# EAGLE design can_switcher (EAGLE 7.5.0)
Development board for an intelligent switching system with CAN bus connectivity
CNAME: Nuclear Bunny Studios, LLC; DESIGNER: Chad Gibbons; EXTRA_DOC: Development Board for an intelligent switching system with CAN bus connectivity; REVISION: 1.0
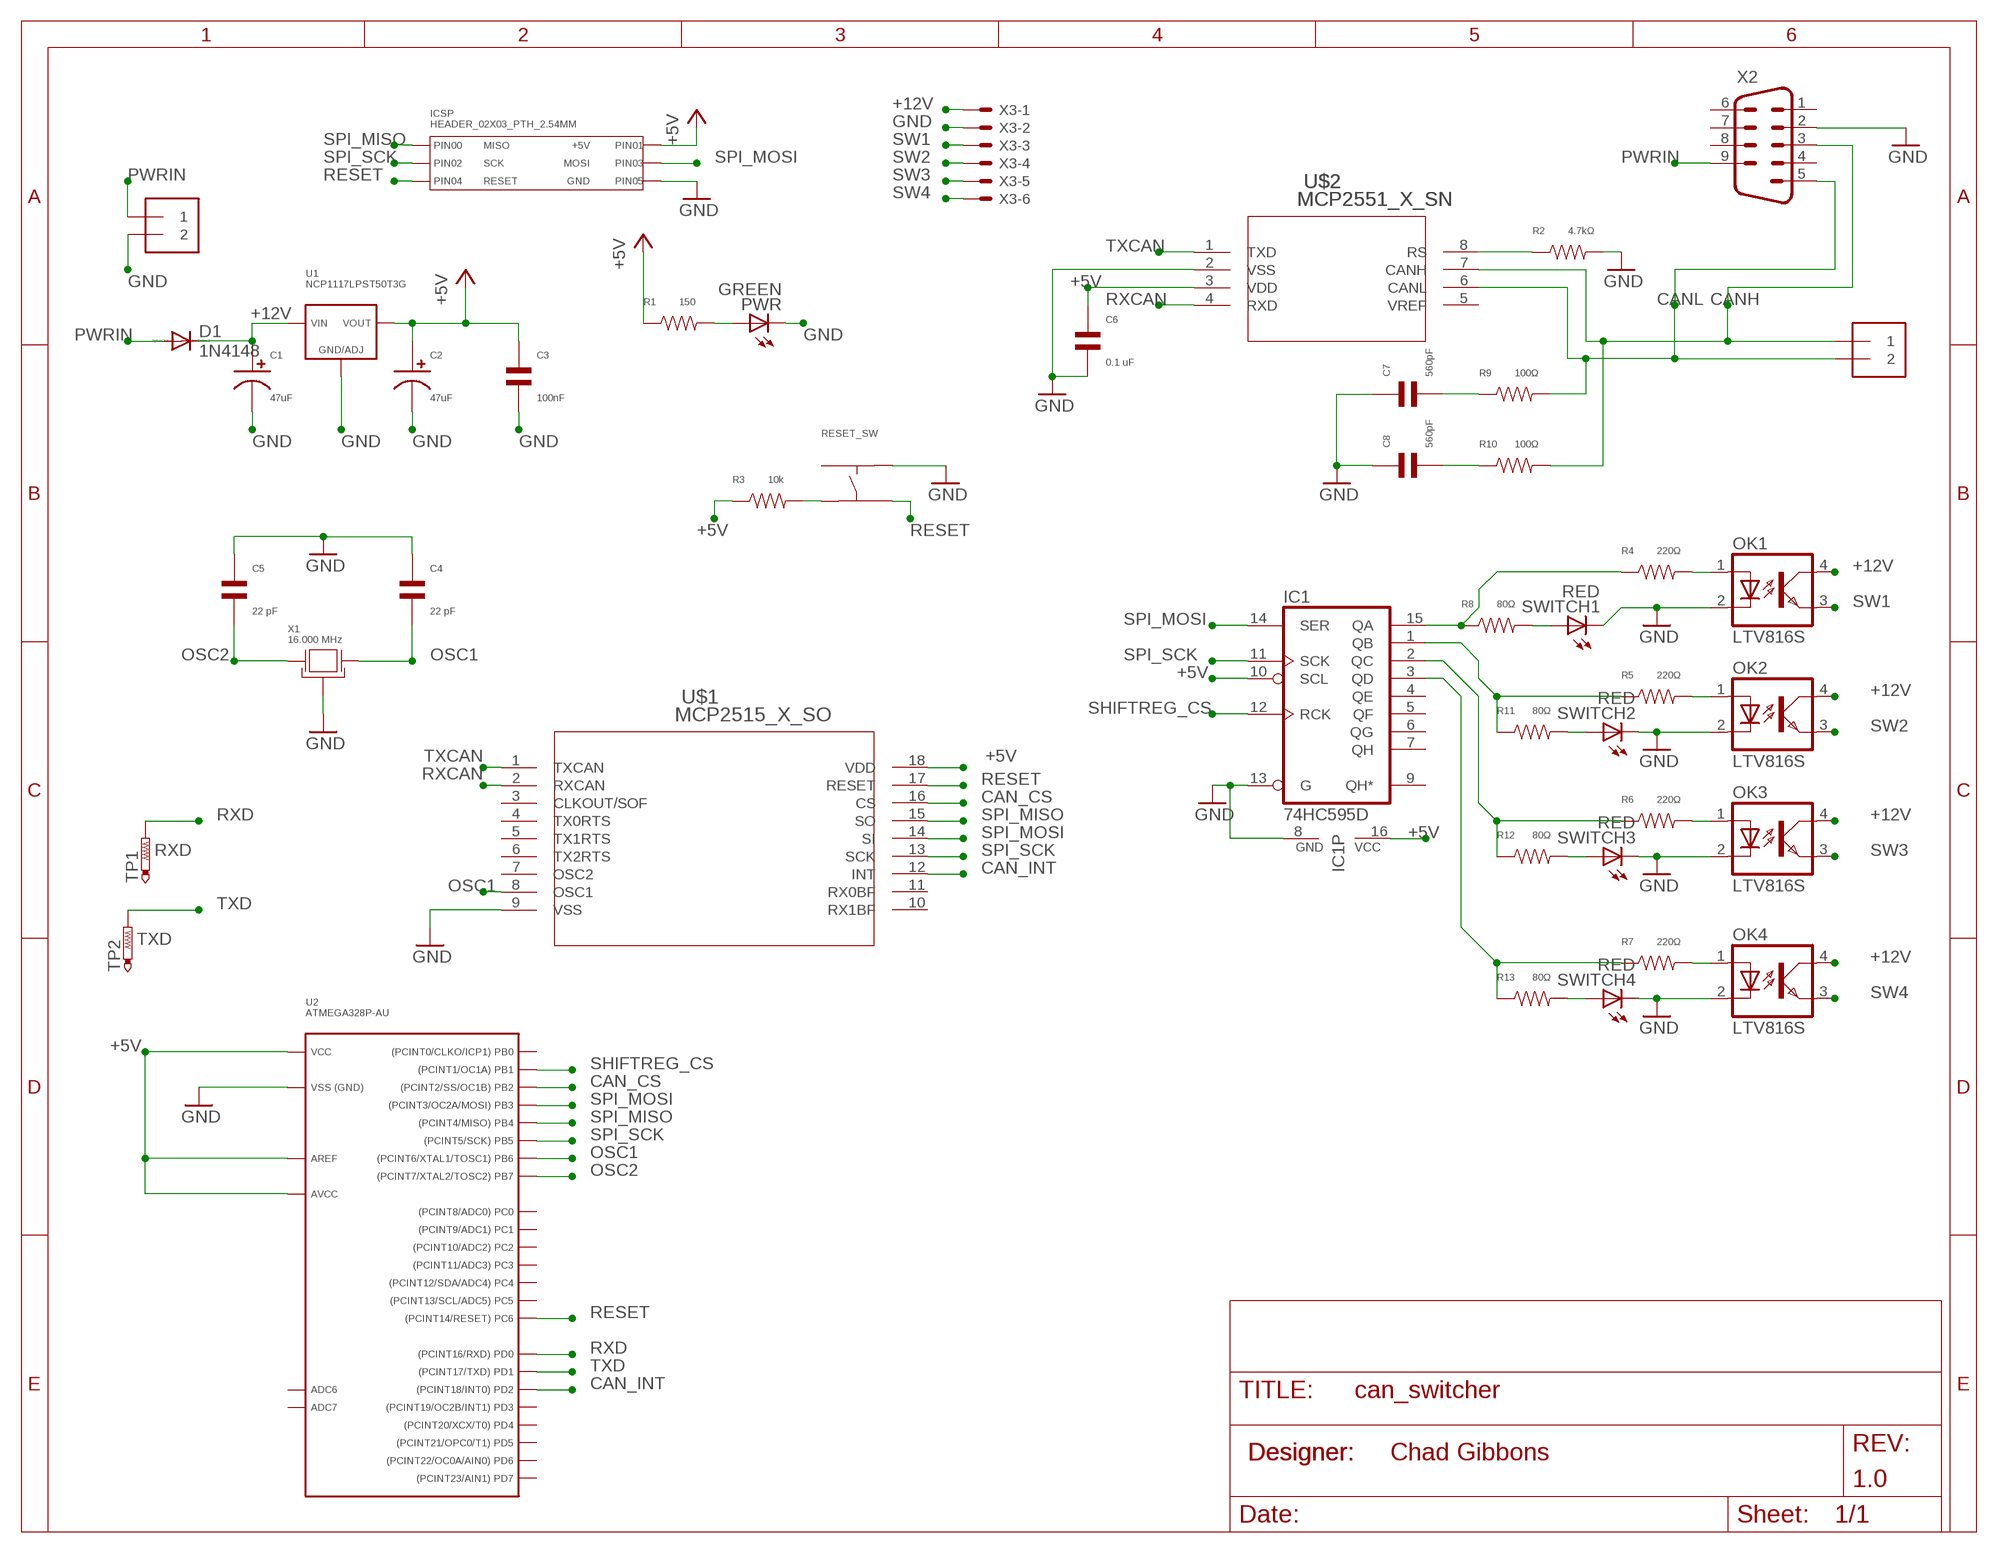
[diagram p0: schematic, sheet 1]

## Parts
C1  47uF  CAPACITOR_P_6.3MM  [CP6.3MM]
C2  47uF  CAPACITOR_P_6.3MM  [CP6.3MM]
C3  100nF  CAPACITOR_NP_0603  [C0603]
C4  22 pF  CAPACITOR_NP_0603  [C0603]
C5  22 pF  CAPACITOR_NP_0603  [C0603]
C6  0.1 uF  CAPACITOR_NP_0603  [C0603]
C7  560pF  CAPACITOR_NP_0603  [C0603]
C8  560pF  CAPACITOR_NP_0603  [C0603]
CANBUS  1X2-3.5MM  [1X2-3.5MM]
D1  1N4148  DIODE-SMB  [SMB]
IC1  74HC595D  [SO16]
ICSP  HEADER_02X03_PTH_2.54MM  [PTH_2.54MM_02X03]
J3  1X2-3.5MM  [1X2-3.5MM]
OK1  LTV816S  [SMD4]
OK2  LTV816S  [SMD4]
OK3  LTV816S  [SMD4]
OK4  LTV816S  [SMD4]
PWR  GREEN  LEDSML0603  [SML0603]
R1  150  RESISTOR_0603  [R0603]
R2  4.7kΩ  RESISTOR_0603  [R0603]
R3  10k  RESISTOR_0603  [R0603]
R4  220Ω  RESISTOR_0603  [R0603]
R5  220Ω  RESISTOR_0603  [R0603]
R6  220Ω  RESISTOR_0603  [R0603]
R7  220Ω  RESISTOR_0603  [R0603]
R8  80Ω  RESISTOR_0603  [R0603]
R9  100Ω  RESISTOR_0603  [R0603]
R10  100Ω  RESISTOR_0603  [R0603]
R11  80Ω  RESISTOR_0603  [R0603]
R12  80Ω  RESISTOR_0603  [R0603]
R13  80Ω  RESISTOR_0603  [R0603]
RESET_SW  TACT_6MM  [TACT6MM]
SWITCH1  RED  LEDSML0603  [SML0603]
SWITCH2  RED  LEDSML0603  [SML0603]
SWITCH3  RED  LEDSML0603  [SML0603]
SWITCH4  RED  LEDSML0603  [SML0603]
TP1  PTR1B1,27  [B1,27]
TP2  PTR1B1,27  [B1,27]
U1  NCP1117LPST50T3G  [SOT-223-3]
U2  ATMEGA328P-AU  [TQFP32]
U$1  MCP2515_X_SO  [SOIC18_W_MC]
U$2  MCP2551_X_SN  [SOIC8_N_MC]
X1  16.000 MHz  XTL_5MMX3.2MM  [5MMX3.2MM]
X2  M09HP  [M09HP]
X3  22-23-2061  [22-23-2061]

## Nets
+5V: C2.P$1 C3.P$1 C6.P$1 IC1.10(SCL) IC1.16(VCC) ICSP.P$2(PIN1) R1.P$1 R3.P$1 U1.P$1(VOUT) U1.P$3(VOUT) U2.P$4(VCC) U2.P$6(VCC) U2.P$18(AVCC) U2.P$20(AREF) U$1.18(VDD) U$2.3(VDD)
+12V: C1.P$1 D1.C OK1.4(COL) OK2.4(COL) OK3.4(COL) OK4.4(COL) U1.P$4(VIN) X3.1
CAN_CS: U2.P$14(PB2) U$1.16(CS)
CAN_INT: U2.P$32(PD2) U$1.12(INT)
CANH: CANBUS.1 R10.P$2 U$2.7(CANH) X2.3
CANL: CANBUS.2 R9.P$2 U$2.6(CANL) X2.5
GND: C1.P$2 C2.P$2 C3.P$2 C4.P$1 C5.P$1 C6.P$2 C7.P$1 C8.P$1 IC1.8(GND) IC1.13(G) ICSP.P$6(PIN5) J3.2 OK1.2(C) OK2.2(C) OK3.2(C) OK4.2(C) PWR.C R2.P$2 RESET_SW.P$2 SWITCH1.C SWITCH2.C SWITCH3.C SWITCH4.C U1.P$2(GND/ADJ) U2.P$3(GND) U2.P$5(GND) U2.P$21(GND) U$1.9(VSS) U$2.2(VSS) X1.P$2(GND) X1.P$4(GND) X2.2 X3.2
N$1: PWR.A R1.P$2
N$2: R2.P$1 U$2.8(RS)
N$3: R3.P$2 RESET_SW.P$3
N$4: R8.P$2 SWITCH1.A
N$9: R11.P$2 SWITCH2.A
N$10: R12.P$2 SWITCH3.A
N$11: R13.P$2 SWITCH4.A
N$17: OK4.1(A) R7.P$2
N$18: OK3.1(A) R6.P$2
N$19: OK2.1(A) R5.P$2
N$20: OK1.1(A) R4.P$2
N$21: IC1.15(QA) R4.P$1 R8.P$1
N$22: IC1.1(QB) R5.P$1 R11.P$1
N$23: IC1.2(QC) R6.P$1 R12.P$1
N$24: IC1.3(QD) R7.P$1 R13.P$1
N$37: C7.P$2 R9.P$1
N$38: C8.P$2 R10.P$1
OSC1: C4.P$2 U2.P$7(PB6) U$1.8(OSC1) X1.P$3(X1)
OSC2: C5.P$2 U2.P$8(PB7) X1.P$1(X0)
PWRIN: D1.A J3.1 X2.9
RESET: ICSP.P$5(PIN4) RESET_SW.P$4 U2.P$29(PC6) U$1.17(RESET)
RXCAN: U$1.2(RXCAN) U$2.4(RXD)
RXD: TP1.TP U2.P$30(PD0)
SHIFTREG_CS: IC1.12(RCK) U2.P$13(PB1)
SPI_MISO: ICSP.P$1(PIN0) U2.P$16(PB4) U$1.15(SO)
SPI_MOSI: IC1.14(SER) ICSP.P$4(PIN3) U2.P$15(PB3) U$1.14(SI)
SPI_SCK: IC1.11(SCK) ICSP.P$3(PIN2) U2.P$17(PB5) U$1.13(SCK)
SW1: OK1.3(EMIT) X3.3
SW2: OK2.3(EMIT) X3.4
SW3: OK3.3(EMIT) X3.5
SW4: OK4.3(EMIT) X3.6
TXCAN: U$1.1(TXCAN) U$2.1(TXD)
TXD: TP2.TP U2.P$31(PD1)
Unconnected: IC1.4(QE) IC1.5(QF) IC1.6(QG) IC1.7(QH) IC1.9(QH*) RESET_SW.P$1 U2.P$1(PD3) U2.P$2(PD4) U2.P$9(PD5) U2.P$10(PD6) U2.P$11(PD7) U2.P$12(PB0) U2.P$19(ADC6) U2.P$22(ADC7) U2.P$23(PC0) U2.P$24(PC1) U2.P$25(PC2) U2.P$26(PC3) U2.P$27(PC4) U2.P$28(PC5) U$1.3(CLKOUT/SOF) U$1.4(TX0RTS) U$1.5(TX1RTS) U$1.6(TX2RTS) U$1.7(OSC2) U$1.10(RX1BF) U$1.11(RX0BF) U$2.5(VREF) X2.1 X2.4 X2.6 X2.7 X2.8

## Library data of the parts
C1 C2 = MF_Passives:CAPACITOR_P: Library: MF_Passives Description: Device for Polarized Capacitors. Manufacture part number (MFG#), Voltage Rating, and Tolerance can be added via Attributes.; MFG#: MF-CAP-6.3MM-47uF; TOLERANCE: N/A; VOTLAGE: N/A
C3-C6 = MF_Passives:CAPACITOR_NP: Library: MF_Passives Description: Device for Non-Polarized Capacitors. Manufacture part number (MFG#), Voltage, Temperature Coefficient, and Tolerance can be added via Attributes.; MFG#: N/A; TEMP_COF: N/A; TOLERANCE: N/A; VOLTAGE: N/A
C7 C8 = MF_Passives:CAPACITOR_NP: Library: MF_Passives Description: Device for Non-Polarized Capacitors. Manufacture part number (MFG#), Voltage, Temperature Coefficient, and Tolerance can be added via Attributes.; MFG#: C0603C561J5GACTU; TEMP_COF: N/A; TOLERANCE: N/A; VOLTAGE: N/A
CANBUS = adafruit:1X2: 3.5mm Terminal block http://www.ladyada.net/library/pcb/eaglelibrary.html; LABEL00: CANH; LABEL01: CANL
D1 = diode:DIODE-: DIODE
IC1 = 74xx-eu:74*595: 8-bit SHIFT REGISTER, output latch
ICSP = MF_Connectors:HEADER_02X03: Library: MF_Connectors Description: Header Connector with 6 Positions and 02 Rows. Use the LABEL Attribute to label the pin on the schematic and PCB. You can remove the attributes on the PCB by using the SMASH function on the part and then deleting the text.; LABEL00: MISO; LABEL01: +5V; LABEL02: SCK; LABEL03: MOSI; LABEL04: RESET; LABEL05: GND
J3 = adafruit:1X2: 3.5mm Terminal block http://www.ladyada.net/library/pcb/eaglelibrary.html
OK1-OK4 = optocoupler:LTV816: OPTO COUPLER Source: LITEON, LTV816.pdf; MPN: LTV-816S-TA; OC_FARNELL: unknown; OC_NEWARK: unknown
PWR SWITCH1-SWITCH4 = led:LED: LED OSRAM: - CHIPLED LG R971, LG N971, LY N971, LG Q971, LY Q971, LO R971, LY R971 LH N974, LH R974 LS Q976, LO Q976, LY Q976 LO Q996 - Hyper CHIPLED LW Q18S LB Q993, LB Q99A, LB R99A - SideLED LS A670, LO A670, LY A670, LG A670, LP A670 LB A673, LV A673, LT A673, LW A673 LH A674 LY A675 LS A676, LA A676, LO A676, LY A676, LW A676 LS A679, LY A679, LG A679 - Hyper Micro SIDELED® LS Y876, LA Y876, LO Y876, LY Y876 LT Y87S - SmartLED LW L88C, LW L88S LB L89C, LB L89S, LG L890 LS L89K, LO L89K, LY L89K LS L896, LA L896, LO L896, LY L896 - TOPLED LS T670, LO T670, LY T670, LG T670, LP T670 LSG T670, LSP T670, LSY T670, LOP T670, LYG T670 LG T671, LOG T671, LSG T671 LB T673, LV T673, LT T673, LW T673 LH T674 LS T676, LA T676, LO T676, LY T676, LB T676, LH T676, LSB T676, LW T676 LB T67C, LV T67C, LT T67C, LS T67K, LO T67K, LY T67K, LW E67C LS E67B, LA E67B, LO E67B, LY E67B, LB E67C, LV E67C, LT E67C LW T67C LS T679, LY T679, LG T679 LS T770, LO T770, LY T770, LG T770, LP T770 LB T773, LV T773, LT T773, LW T773 LH T774 LS E675, LA E675, LY E675, LS T675 LS T776, LA T776, LO T776, LY T776, LB T776 LHGB T686 LT T68C, LB T68C - Hyper Mini TOPLED® LB M676 - Mini TOPLED Santana® LG M470 LS M47K, LO M47K, LY M47K Source: http://www.osram.convergy.de LUXEON: - LUMILED® LXK2-PW12-R00, LXK2-PW12-S00, LXK2-PW14-U00, LXK2-PW14-V00 LXK2-PM12-R00, LXK2-PM12-S00, LXK2-PM14-U00 LXK2-PE12-Q00, LXK2-PE12-R00, LXK2-PE12-S00, LXK2-PE14-T00, LXK2-PE14-U00 LXK2-PB12-K00, LXK2-PB12-L00, LXK2-PB12-M00, LXK2-PB14-N00, LXK2-PB14-P00, LXK2-PB14-Q00 LXK2-PR12-L00, LXK2-PR12-M00, LXK2-PR14-Q00, LXK2-PR14-R00 LXK2-PD12-Q00, LXK2-PD12-R00, LXK2-PD12-S00 LXK2-PH12-R00, LXK2-PH12-S00 LXK2-PL12-P00, LXK2-PL12-Q00, LXK2-PL12-R00 Source: www.luxeon.com KINGBRIGHT: KA-3528ASYC Source: www.kingbright.com
R1 = MF_Passives:RESISTOR: Library: MF_Passives Description: Device for Resistors. Manufacture part number (MFG#), Voltage, Tolerance, and Wattage Rating can be added via Attributes.; MFG#: RC0603FR-07150RL; TOLERANCE: N/A; VOLTAGE: N/A; WATTAGE: N/A
R2-R13 = MF_Passives:RESISTOR: Library: MF_Passives Description: Device for Resistors. Manufacture part number (MFG#), Voltage, Tolerance, and Wattage Rating can be added via Attributes.; MFG#: N/A; TOLERANCE: N/A; VOLTAGE: N/A; WATTAGE: N/A
RESET_SW = MF_Switches:TACT: Library: MF_Switches Description: Device for Tact Switches. Manufacture part number (MFG#) can be added via Attributes.; MFG#: MF-SW-TACT-6MM
TP1 = testpad:PTR1: TEST PIN; TP_SIGNAL_NAME: RXD
TP2 = testpad:PTR1: TEST PIN; TP_SIGNAL_NAME: TXD
U1 = MF_IC_Power:NCP1117LP: Manufacturer Part #: NCP1117LP Manufacturer: ON Semiconductor Description: LDO Voltage Regulators
U2 = MF_IC_Digital:ATMEGA328P: Manufacturer Part #: ATMEGA328P Manufacturer: Atmel Description: 8-bit Microcontrollers - MCU 32KB In-system Flash 20MHz 1.8V-5.5V
U$1 = microchip_can:MCP2515_X_SO
U$2 = microchip_can:MCP2551_X_SN
X1 = MF_Frequency_Control:XTL: Library: MF_Frequency_Control Description: Device for Cyrstal Oscillators. Manufacture part number (MFG#) can be added via Attributes.; MFG#: ASFL1-16.000MHZ-EC-T
X2 = con-subd:M09: SUB-D; MPN: L717SDE09P1ACH; OC_FARNELL: unknown; OC_NEWARK: unknown
X3 = con-molex:22-23-2061: .100" (2.54mm) Center Header - 6 Pin; MF: MOLEX; MPN: 22-23-2061; OC_FARNELL: 1462922; OC_NEWARK: 27C1933

## Board
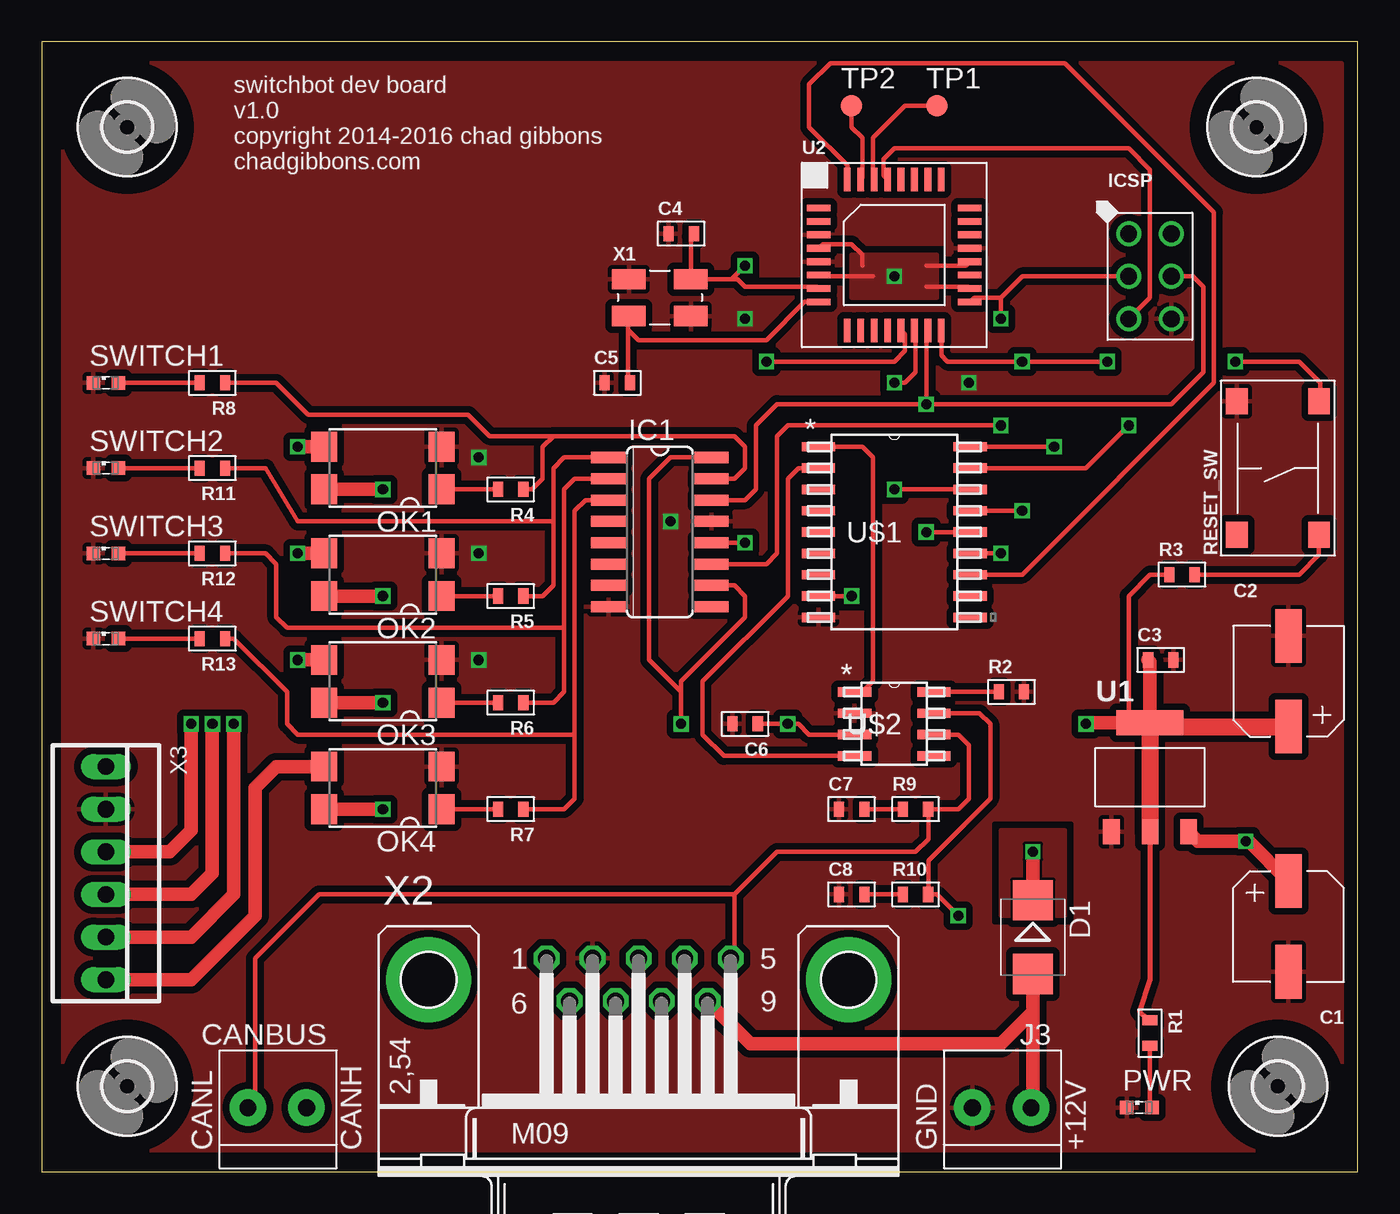
[diagram p1: board, top side]
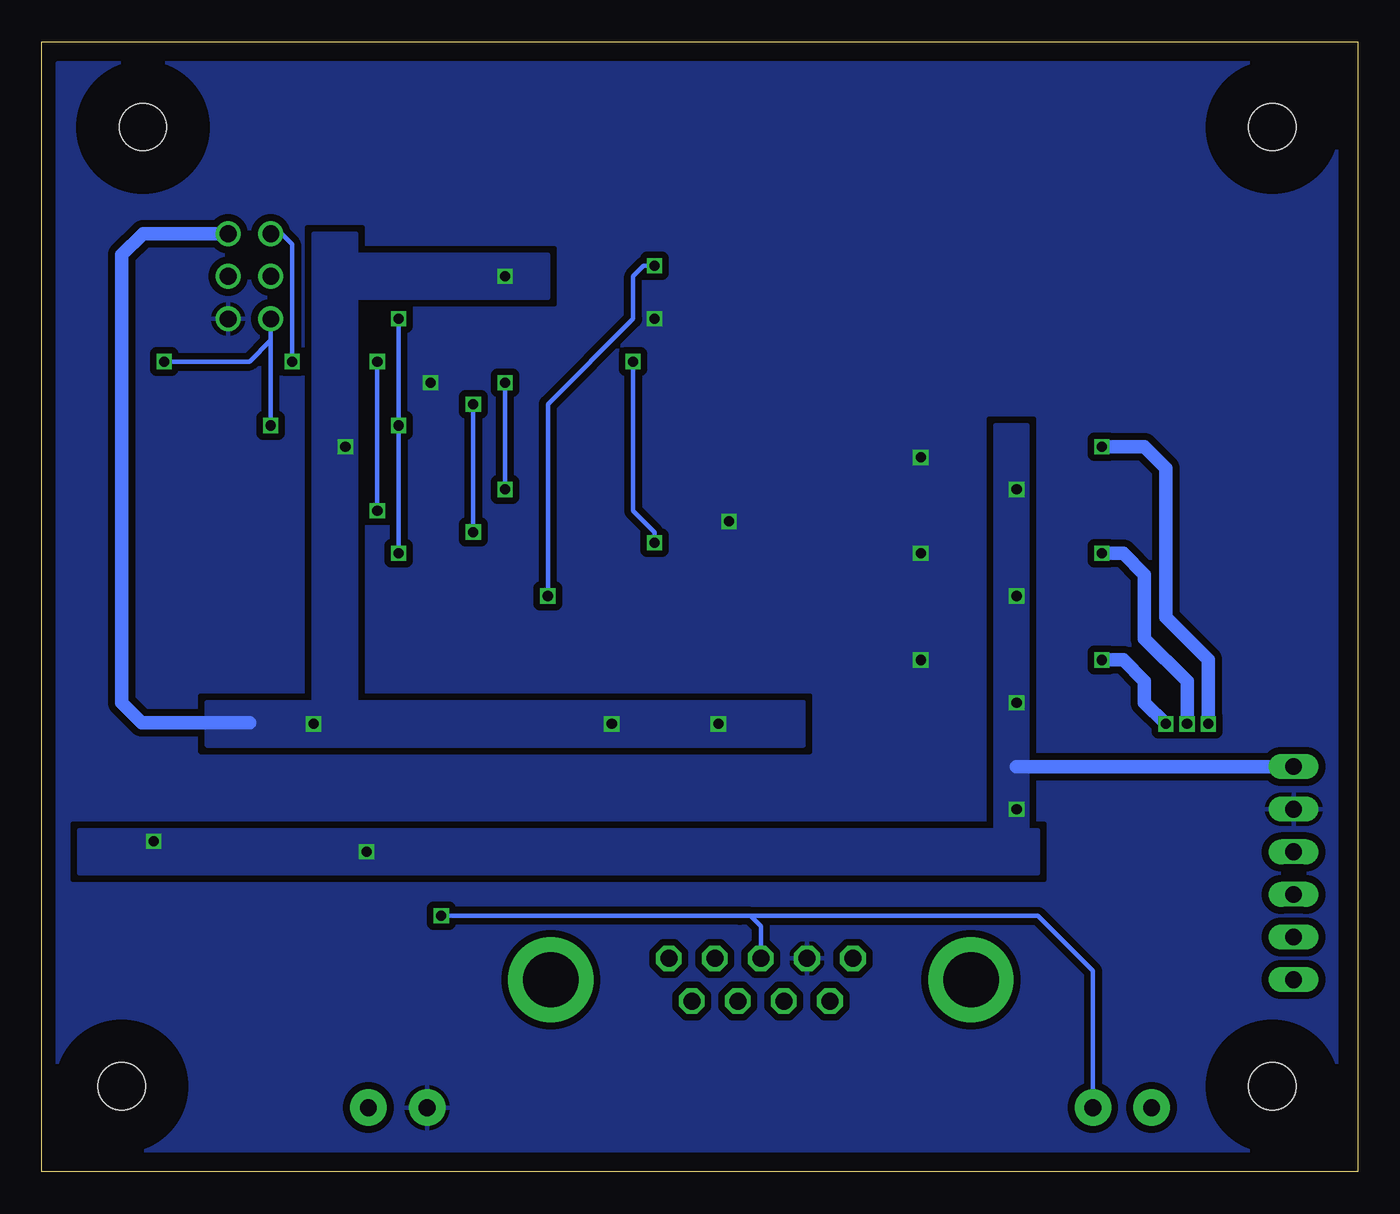
[diagram p2: board, bottom side, seen from below]

Size 78.41 x 67.3 mm. Coordinates in mm from the lower left corner, seen from the top.
Outline: 0,0 78.41,0 78.41,67.3 0,67.3 0,0
Copper layers (1*16): Top 0.035mm / dielectric 0.2mm / Bottom 0.035mm
Design rules "MF_2_Layer": minimum track width 6mil, minimum drill 12mil, track to track 6mil, track to pad 6mil, pad to pad 6mil, via to via 6mil, smd to smd 0mil, copper to edge 10mil, drill to drill 10mil, minimum pad ring 6mil, minimum via ring 6mil, stop-mask expansion 2mil, vias tented up to drill 25mil, thermal gap 10mil

### Footprints (pad centres in the part's own frame; a part is rotated, then mirrored left to right if it is on the bottom)
CP6.3MM = smd 1.6 x 3.2: P$1 0,-2.7; P$2 0,2.7
C0603 = smd 0.6 x 0.9: P$1 -0.75,0; P$2 0.75,0
1X2-3.5MM = drill 1 pad 2.184: 1 1.8,0; 2 -1.7,0
SMB = smd 2.4 x 2.4: A 2.2,0; C -2.2,0
SO16 = smd 0.66 x 2.032: 1 -4.445,-3.073; 2 -3.175,-3.073; 3 -1.905,-3.073; 4 -0.635,-3.073; 5 0.635,-3.073; 6 1.905,-3.073; 7 3.175,-3.073; 8 4.445,-3.073; 9 4.445,3.073; 10 3.175,3.073; 11 1.905,3.073; 12 0.635,3.073; 13 -0.635,3.073; 14 -1.905,3.073; 15 -3.175,3.073; 16 -4.445,3.073
PTH_2.54MM_02X03 = drill 1: P$1 -2.54,-1.27; P$2 -2.54,1.27; P$3 0,-1.27; P$4 0,1.27; P$5 2.54,-1.27; P$6 2.54,1.27
SMD4 = smd 1.78 x 1.55: 1 -1.27,-3.5; 2 1.27,-3.5; 3 1.27,3.5; 4 -1.27,3.5
SML0603 = smd 0.8 x 0.8: A 0.75,0; C -0.75,0
R0603 = smd 0.6 x 0.9: P$1 -0.75,0; P$2 0.75,0
TACT6MM = smd 1.55 x 1.3: P$1 -3.975,2.45; P$2 3.975,2.45; P$3 -3.975,-2.45; P$4 3.975,-2.45
B1,27 = smd 1.27 x 1.27: TP 0,0
SOT-223-3 = smd 4 x 1.5: P$1 0,3.25 | smd 1 x 1.5: P$2 -2.3,-3.25; P$3 0,-3.25; P$4 2.3,-3.25
TQFP32 = smd 1.4 x 0.4: P$1 -4.5,2.8; P$2 -4.5,2; P$3 -4.5,1.2; P$4 -4.5,0.4; P$5 -4.5,-0.4; P$6 -4.5,-1.2; P$7 -4.5,-2; P$8 -4.5,-2.8; P$17 4.5,-2.8; P$18 4.5,-2; P$19 4.5,-1.2; P$20 4.5,-0.4; P$21 4.5,0.4; P$22 4.5,1.2; P$23 4.5,2; P$24 4.5,2.8 | smd 0.4 x 1.4: P$9 -2.8,-4.5; P$10 -2,-4.5; P$11 -1.2,-4.5; P$12 -0.4,-4.5; P$13 0.4,-4.5; P$14 1.2,-4.5; P$15 2,-4.5; P$16 2.8,-4.5; P$25 2.8,4.5; P$26 2,4.5; P$27 1.2,4.5; P$28 0.4,4.5; P$29 -0.4,4.5; P$30 -1.2,4.5; P$31 -2,4.5; P$32 -2.8,4.5
SOIC18_W_MC = smd 1.981 x 0.559: 1 -4.521,5.08; 2 -4.521,3.81; 3 -4.521,2.54; 4 -4.521,1.27; 5 -4.521,0; 6 -4.521,-1.27; 7 -4.521,-2.54; 8 -4.521,-3.81; 9 -4.521,-5.08; 10 4.521,-5.08; 11 4.521,-3.81; 12 4.521,-2.54; 13 4.521,-1.27; 14 4.521,0; 15 4.521,1.27; 16 4.521,2.54; 17 4.521,3.81; 18 4.521,5.08
SOIC8_N_MC = smd 1.981 x 0.559: 1 -2.362,1.905; 2 -2.362,0.635; 3 -2.362,-0.635; 4 -2.362,-1.905; 5 2.362,-1.905; 6 2.362,-0.635; 7 2.362,0.635; 8 2.362,1.905
2,8 = hole 2.8: 0,0
5MMX3.2MM = smd 2 x 1.2: P$1 -1.85,-1.1; P$2 1.85,-1.1; P$3 1.85,1.1; P$4 -1.85,1.1
M09HP = drill 1.016 octagon: 1 -5.486,1.27; 2 -2.743,1.27; 3 0,1.27; 4 2.743,1.27; 5 5.486,1.27; 6 -4.115,-1.27; 7 -1.372,-1.27; 8 1.372,-1.27; 9 4.115,-1.27 | drill 3.302 pad 5.08: G1 -12.522,0; G2 12.522,0
22-23-2061 = drill 1 long: 1 -6.35,0; 2 -3.81,0; 3 -1.27,0; 4 1.27,0; 5 3.81,0; 6 6.35,0

### Placement (x,y rotation side)
C1  74.3,14.61 180 top
C2  74.3,29.21 0 top
C3  66.67,30.48 0 top
C4  38.1,55.88 0 top
C5  34.29,46.99 0 top
C6  41.91,26.67 180 top
C7  48.26,21.59 0 top
C8  48.26,16.51 0 top
CANBUS  13.97,3.81 0 top
D1  59.05,13.97 270 top
IC1  36.83,38.1 270 top
ICSP  66.04,53.34 270 top
J3  57.15,3.81 0 top
OK1  20.32,41.91 90 top
OK2  20.32,35.56 90 top
OK3  20.32,29.21 90 top
OK4  20.32,22.86 90 top
PWR  65.41,3.81 0 top
R1  66.04,8.26 270 top
R2  57.78,28.57 0 top
R3  67.94,35.56 0 top
R4  27.94,40.64 180 top
R5  27.94,34.29 180 top
R6  27.94,27.94 180 top
R7  27.94,21.59 180 top
R8  10.16,46.99 180 top
R9  52.07,21.59 0 top
R10  52.07,16.51 0 top
R11  10.16,41.91 180 top
R12  10.16,36.83 180 top
R13  10.16,31.75 180 top
RESET_SW  73.66,41.91 90 top
SWITCH1  3.81,46.99 0 top
SWITCH2  3.81,41.91 0 top
SWITCH3  3.81,36.83 0 top
SWITCH4  3.81,31.75 0 top
TP1  53.34,63.5 0 top
TP2  48.26,63.5 0 top
U1  66.04,23.5 0 top
U2  50.8,54.61 0 top
U$1  50.8,38.1 0 top
U$2  50.8,26.67 0 top
U$3  [2,8]  5.08,5.08 0 top
U$4  [2,8]  73.66,5.08 0 top
U$5  [2,8]  72.39,62.23 0 top
U$6  [2,8]  5.08,62.23 0 top
X1  36.83,52.07 0 top
X2  35.56,11.43 0 top
X3  3.81,17.78 270 top

### Tracks (layer width: path | path; a pad name or v marks a point on that pad's centre or on a via)
+5V  (via drill 0.6)
  Top 0.254: C6.P$1 v44.45,26.67 45.09,26.67 45.72,26.04 U$2.3 | 38.1,28.57 38.1,29.21 41.91,33.02 41.91,34.29 41.27,34.92 IC1.10 | 38.1,28.57 v38.1,26.67 | U2.P$6 46.37,53.34 49.53,53.34 | U2.P$18 55.2,52.7 52.7,52.7 | U2.P$4 46.53,55.24 48.26,55.24 48.9,54.61 48.9,53.98 | R3.P$1 66.04,35.56 64.77,34.29 64.77,26.75 | U2.P$20 55.06,53.98 52.7,53.98 | U$1.18 v60.33,43.18 | IC1.16 37.47,42.55 36.2,41.27 36.2,30.48 38.1,28.57
  Top 0.305: U1.P$3 66.04,11.43 65.41,9.53 R1.P$1
  Top 0.813: v62.23,26.67 62.3,26.75 64.77,26.75 U1.P$1 66.04,30.36 C3.P$1
  Top 1.016: U1.P$3 U1.P$1 66.28,26.51 C2.P$1
  Bottom 0.813: ICSP.P$2 72.39,55.88 73.66,54.61 73.66,27.94 72.47,26.75 U1.P$1
  other vias: 50.8,53.34
  pour Bottom (isolate 0.305): 68.58,27.94 68.58,25.4 33.02,25.4 33.02,27.94
  pour Top: 48.26,54.61 48.26,52.07 53.34,52.07 53.34,54.61
  pour Bottom: 59.69,25.4 62.23,25.4 62.23,55.88 59.69,55.88
  pour Bottom: 48.26,54.61 62.23,54.61 62.23,52.07 48.26,52.07
+12V  (via drill 0.6)
  Top 0.813: OK4.4 v20.32,21.59 | OK3.4 v20.32,27.94 | OK2.4 v20.32,34.29 | OK1.4 v20.32,40.64 | U1.P$4 68.9,19.68 v71.75,19.68 71.92,19.68 C1.P$1 | D1.C v59.05,19.05
  Bottom 0.813: X3.1 20.32,24.13
  pour Bottom (rank 2): 19.68,20.32 21.59,20.32 21.59,44.45 19.68,44.45
  pour Bottom (isolate 0.305): 76.2,20.32 76.2,17.78 19.05,17.78 19.05,20.32
CAN_CS  (via drill 0.6)
  Top 0.254: U2.P$14 52.07,50.04 52.07,47.62 51.44,46.99 v50.8,46.99 | U$1.16 v50.8,40.64
  Bottom 0.254: v50.8,40.64 v50.8,46.99
CAN_INT
  Top 0.254: U2.P$32 48,59.95 45.72,62.23 45.72,64.77 46.99,66.04 60.96,66.04 69.85,57.15 69.85,46.99 58.42,35.56 U$1.12
CANH  (via drill 0.6)
  Top 0.254: v54.61,15.24 53.34,16.51 R10.P$2 52.82,18.53 56.52,22.23 56.52,26.67 55.88,27.3 U$2.7
  Bottom 0.254: X2.3 35.56,14.61 36.2,15.24 | 36.2,15.24 36.83,15.24 v54.61,15.24 | 36.2,15.24 19.05,15.24 15.77,11.96 CANBUS.1
CANL
  Top 0.254: X2.5 41.27,12.93 41.27,16.51 | 41.27,16.51 43.81,19.05 52.07,19.05 52.82,19.8 R9.P$2 54.61,21.59 55.24,22.23 55.24,25.4 54.61,26.04 U$2.6 | CANBUS.2 12.7,4.24 12.7,12.7 16.51,16.51 41.27,16.51
GND  (via drill 0.6)
  other vias: 26.04,42.55 26.04,36.83 26.04,30.48 41.91,50.8 55.24,46.99 37.47,38.73
  pour Top (isolate 0.406, rank 6): 1.27,66.04 1.27,1.27 77.47,1.27 77.47,66.04
  pour Bottom (isolate 0.406, rank 6): 1.27,66.04 1.27,1.27 77.47,1.27 77.47,66.04
  pour Top: 10.16,66.04 10.16,58.42 41.91,58.42 41.91,66.04
N$1
  Top 0.254: PWR.A 66.04,3.92 R1.P$2
N$2
  Top 0.254: U$2.8 R2.P$1
N$3
  Top 0.254: R3.P$2 74.93,35.56 76.11,36.74 RESET_SW.P$3
N$4
  Top 0.254: R8.P$2 SWITCH1.A
N$9
  Top 0.254: R11.P$2 SWITCH2.A
N$10
  Top 0.254: R12.P$2 SWITCH3.A
N$11
  Top 0.254: R13.P$2 SWITCH4.A
N$12
  pour Top: 57.15,15.24 60.96,15.24 60.96,20.32 57.15,20.32
N$17
  Top 0.254: R7.P$2 OK4.1
N$18
  Top 0.254: OK3.1 R6.P$2
N$19
  Top 0.254: R5.P$2 OK2.1
N$20
  Top 0.254: OK1.1 R4.P$2
N$21
  Top 0.254: IC1.15 41.27,41.27 41.91,41.91 41.91,43.18 41.27,43.81 30.48,43.81 | 30.48,43.81 29.84,43.18 29.84,41.27 29.21,40.64 R4.P$1 | R8.P$1 13.97,46.99 15.88,45.09 25.4,45.09 26.67,43.81 30.48,43.81
N$22
  Top 0.254: IC1.1 31.11,42.55 30.48,41.91 30.48,38.73 | 30.48,38.73 30.48,34.92 29.84,34.29 R5.P$1 | R11.P$1 13.34,41.91 15.24,38.73 30.48,38.73
N$23
  Top 0.254: IC1.2 31.75,41.27 31.11,40.64 31.11,32.38 | 31.11,32.38 31.11,28.57 30.48,27.94 R6.P$1 | 31.11,32.38 14.61,32.38 13.97,33.02 13.97,36.2 13.34,36.83 R12.P$1
N$24
  Top 0.254: IC1.3 32.38,40.01 31.75,39.37 31.75,26.04 | 31.75,26.04 31.75,22.23 31.11,21.59 R7.P$1 | 31.75,26.04 15.24,26.04 14.61,26.67 14.61,28.57 11.43,31.75 R13.P$1
N$37
  Top 0.254: R9.P$1 C7.P$2
N$38
  Top 0.254: R10.P$1 C8.P$2
OSC1  (via drill 0.6)
  Top 0.254: U2.P$7 46.2,52.7 41.91,52.7 41.45,53.17 41.1,53.17 | 41.1,53.17 X1.P$3 38.68,55.71 C4.P$2 | v41.91,53.98 41.1,53.17 | U$1.8 v48.26,34.29
  Bottom 0.254: v48.26,34.29 48.26,45.72 43.18,50.8 43.18,53.34 42.55,53.98 v41.91,53.98
OSC2
  Top 0.254: X1.P$1 34.92,50.91 34.92,50.16 | 34.92,50.16 35.56,49.53 43.18,49.53 45.46,51.81 U2.P$8 | C5.P$2 34.92,47.1 34.92,50.16
PWRIN
  Top 0.813: X2.9 42.22,7.62 57.15,7.62 59.05,9.53 D1.A 59.05,3.92 J3.1
RESET  (via drill 0.6)
  Top 0.254: U2.P$29 50.16,59.34 50.16,60.33 50.8,60.96 64.77,60.96 66.04,59.69 66.04,52.07 ICSP.P$5 | U$1.17 62.23,41.91 v64.77,44.45 | RESET_SW.P$4 76.2,45.98 76.2,46.99 74.93,48.26 v71.12,48.26
  Bottom 0.254: v71.12,48.26 66.04,48.26 64.77,49.53 | 64.77,49.53 ICSP.P$5 | v64.77,44.45 64.77,49.53
RXCAN
  Top 0.254: U$2.4 40.64,24.77 39.37,26.04 39.37,29.21 44.45,34.29 44.45,41.27 45.09,41.91 U$1.2
RXD
  Top 0.254: U2.P$30 49.53,59.18 49.53,61.59 51.44,63.5 TP1.TP
SHIFTREG_CS  (via drill 0.6)
  Top 0.254: U2.P$13 51.44,49.88 51.44,48.9 50.8,48.26 v43.18,48.26 | IC1.12 v41.91,37.47
  Bottom 0.254: v43.18,48.26 43.18,39.37 41.91,38.1 v41.91,37.47
SPI_MISO  (via drill 0.6)
  Top 0.254: U2.P$16 53.6,48.63 53.98,48.26 v58.42,48.26 v63.5,48.26 | U$1.15 v58.42,39.37
  Bottom 0.254: ICSP.P$1 64.14,55.88 63.5,55.24 v63.5,48.26 | v58.42,48.26 v58.42,39.37
SPI_MOSI  (via drill 0.6)
  Top 0.254: U2.P$15 52.7,50.02 v52.7,45.72 | v52.7,38.1 U$1.14 | IC1.14 41.91,40.01 42.55,40.64 42.55,44.45 43.81,45.72 v52.7,45.72 | ICSP.P$4 68.58,53.34 69.22,52.7 69.22,47.62 67.31,45.72 v52.7,45.72
  Bottom 0.254: v52.7,45.72 v52.7,38.1
SPI_SCK  (via drill 0.6)
  Top 0.254: IC1.11 43.18,36.2 43.81,36.83 43.81,43.81 44.45,44.45 v57.15,44.45 | U$1.13 v57.15,36.83 | ICSP.P$3 58.42,53.34 57.15,52.07 | v57.15,50.8 57.15,52.07 | U2.P$17 55.56,52.07 57.15,52.07
  Bottom 0.254: v57.15,36.83 v57.15,44.45 v57.15,50.8
SW1  (via drill 0.6)
  Top 0.813: X3.3 7.62,19.05 8.89,20.32 v8.89,26.67 | v15.24,43.18 OK1.3
  Bottom 0.813: v8.89,26.67 8.89,30.48 11.43,33.02 11.43,41.91 12.7,43.18 v15.24,43.18
SW2  (via drill 0.6)
  Top 0.813: X3.4 8.89,16.51 10.16,17.78 v10.16,26.67 | v15.24,36.83 OK2.3
  Bottom 0.813: 10.16,27.94 v10.16,26.67 10.16,29.21 12.7,31.75 12.7,35.56 13.97,36.83 v15.24,36.83
SW3  (via drill 0.6)
  Top 0.813: X3.5 8.89,13.97 11.43,16.51 v11.43,26.67 | v15.24,30.48 OK3.3
  Bottom 0.813: v11.43,26.67 12.7,27.94 12.7,29.21 13.97,30.48 v15.24,30.48
SW4
  Top 0.813: OK4.3 13.97,24.13 12.7,22.86 12.7,15.24 8.89,11.43 X3.6
TXCAN
  Top 0.254: U$1.1 48.9,43.18 49.53,42.55 49.53,29.21 48.9,28.57 U$2.1
TXD
  Top 0.254: U2.P$31 48.9,59.2 48.9,61.59 48.26,62.23 TP2.TP

### Text on the board
tNames: switchbot dev board / v1.0 / copyright 2014-2016 chad gibbons / chadgibbons.com | CANL | CANH | GND | +12V